# EAGLE board oresat-c3-v1_WRONG_FTDI (EAGLE 9.5.2)
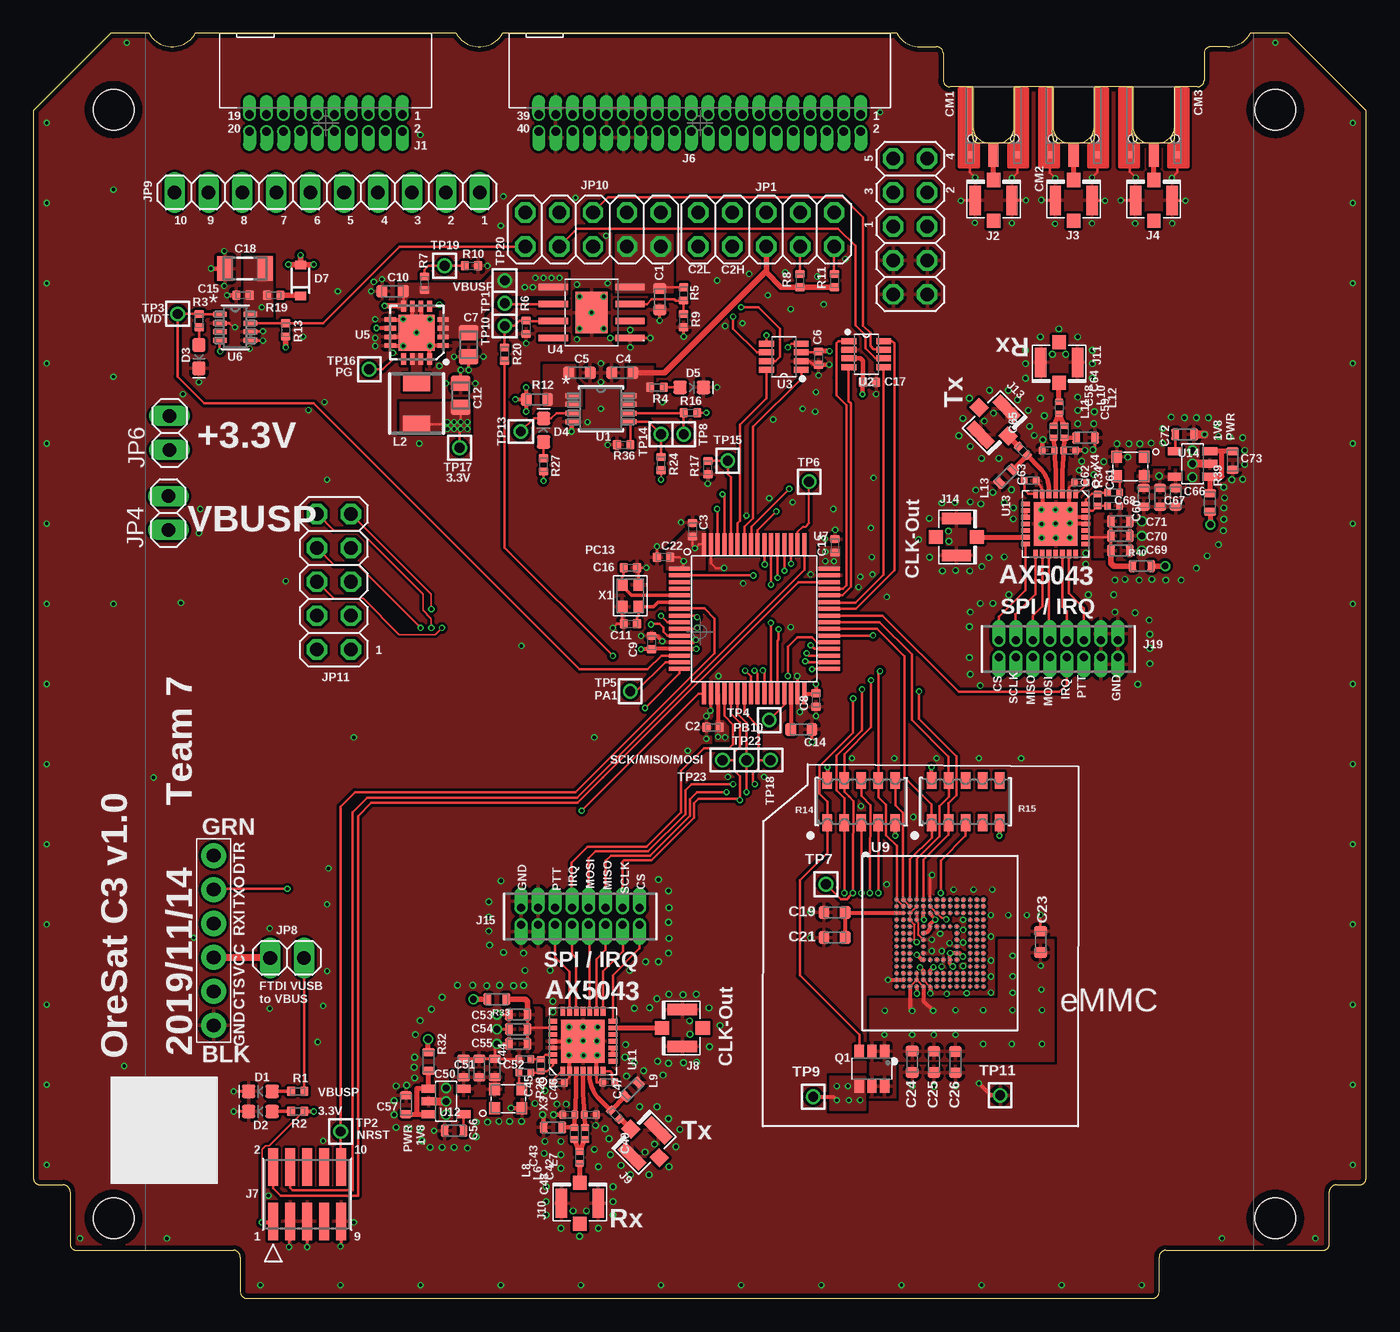
[diagram p5: board, top side]
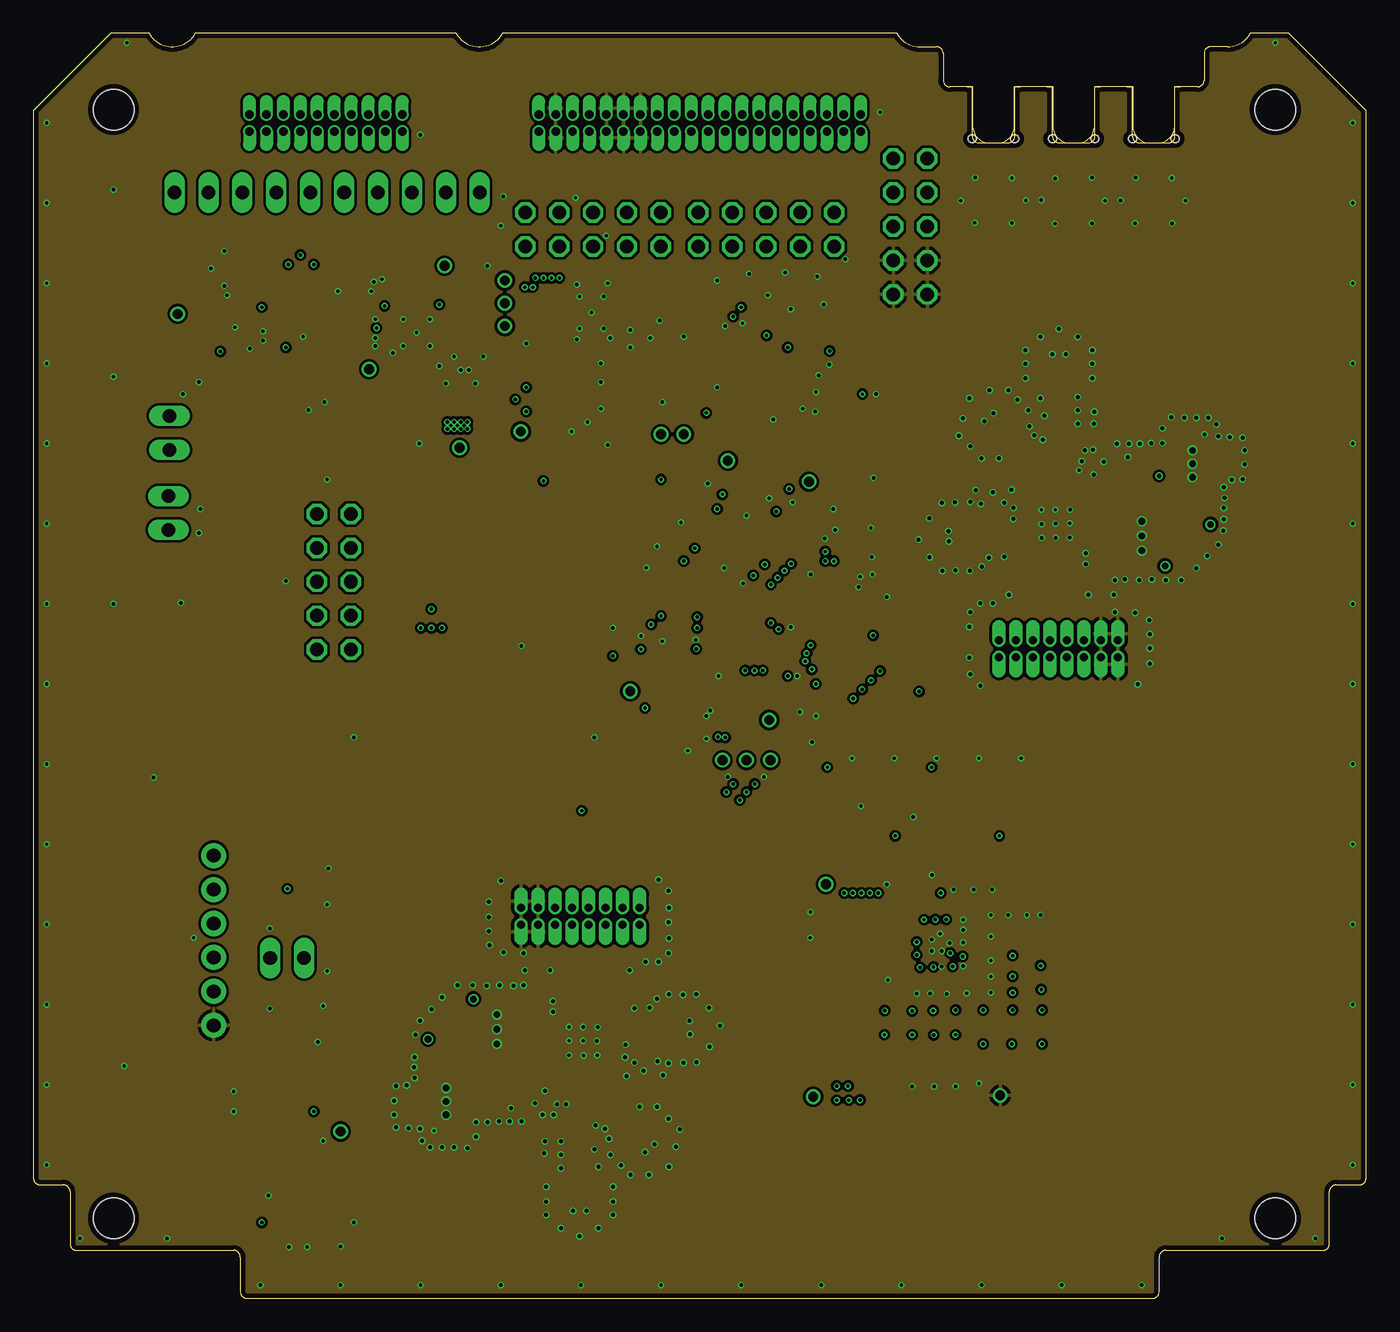
[diagram p6: board, inner layer Route2]
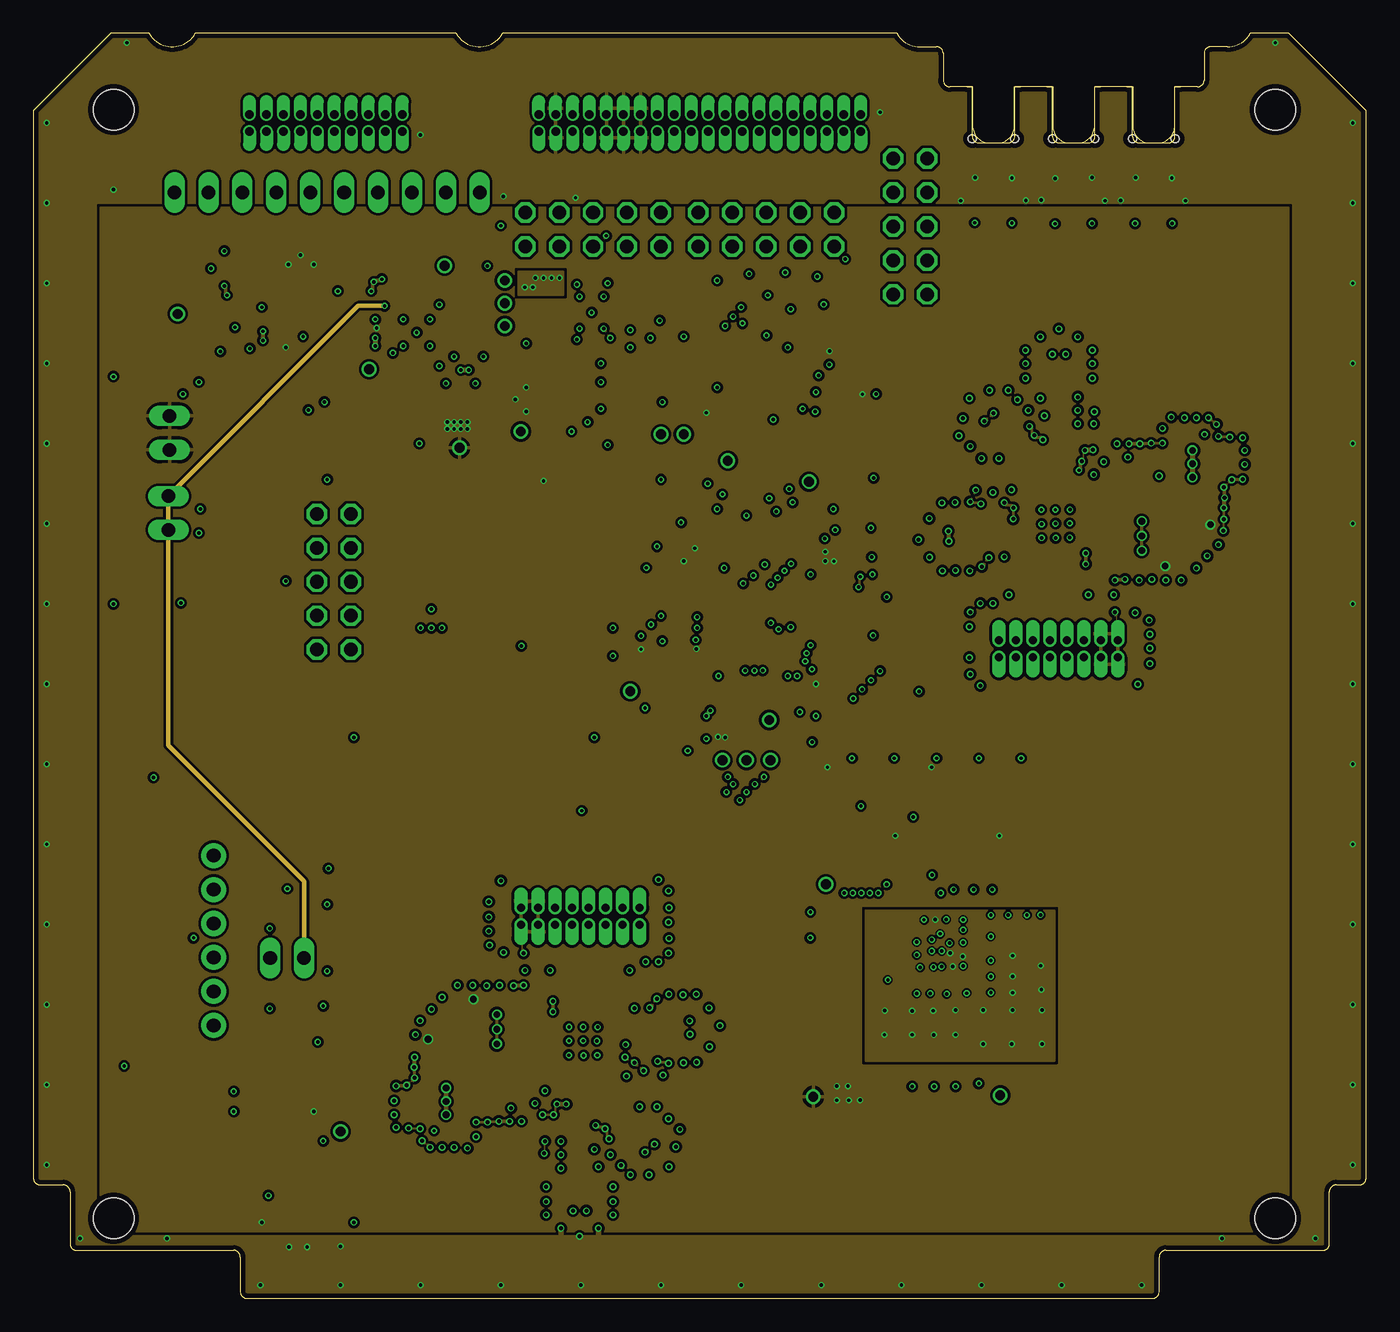
[diagram p7: board, inner layer route]
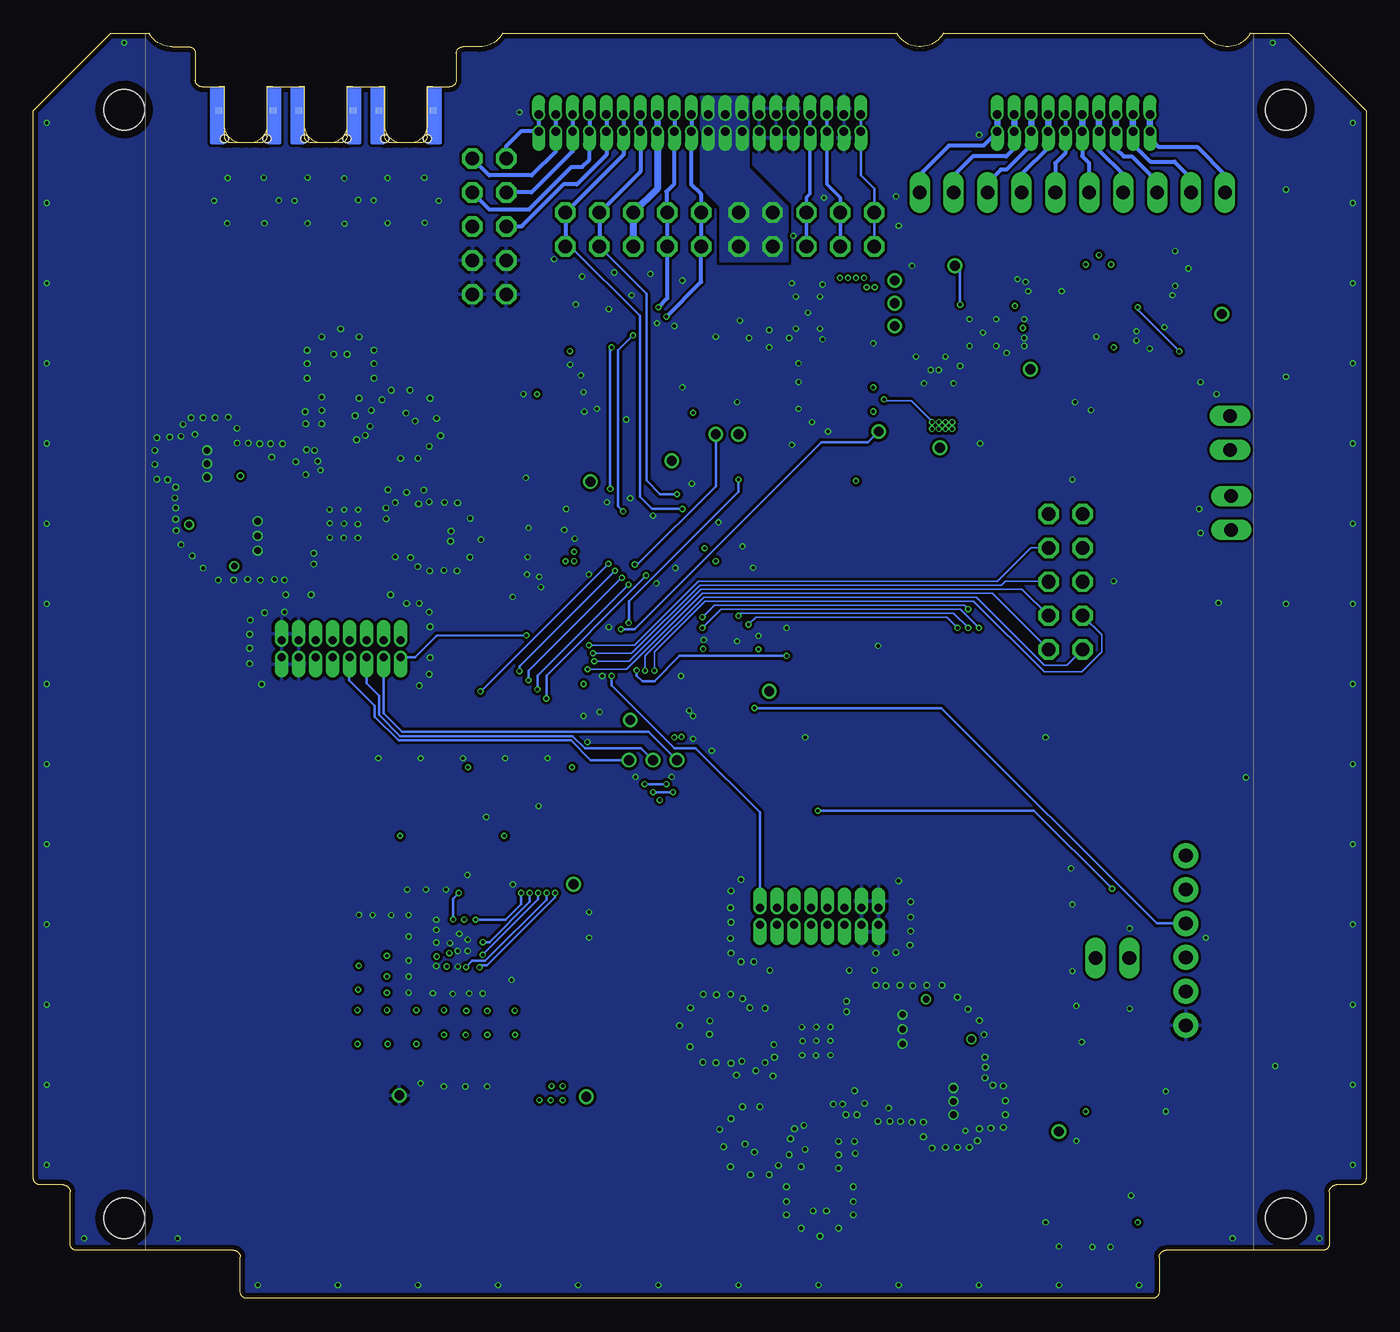
[diagram p8: board, bottom side, seen from below]

Size 99.8 x 94.7 mm. Coordinates in mm from the lower left corner, seen from the top.
Copper layers (1*2*15*16): Top 0.035559375mm / dielectric 0.17018125mm / Route2 0.01778125mm / dielectric 47mil / route 0.01778125mm / dielectric 0.17018125mm / Bottom 0.035559375mm
Design rules "oshpark-4layer *": minimum track width 5mil, minimum drill 10mil, track to track 5mil, track to pad 5mil, pad to pad 5mil, via to via 5mil, smd to smd 5mil, copper to edge 15mil, drill to drill 6mil, minimum pad ring 4mil, minimum via ring 4mil, stop-mask expansion 2.5mil, vias tented up to drill 10mil, thermal gap 10mil
Net classes: 1 RF1: clearance 0.8 mm; 2 RF2: clearance 0.4 mm

## Footprints (pad centres in the part's own frame; a part is rotated, then mirrored left to right if it is on the bottom)
.0603-B-NOSILK = smd 0.8 x 0.95: 1 -0.8,0; 2 0.8,0
.0402-B-NOSILK = smd 0.6 x 0.7: 1 -0.5,0; 2 0.5,0
.0805-B-NOSILK = smd 1.15 x 1.45: 1 -0.9,0; 2 0.9,0
1206-B = smd 1.15 x 1.8: 1 -1.5,0; 2 1.5,0
.0402-C-NOSILK = smd 0.5 x 0.6: 1 -0.45,0; 2 0.45,0
.0603-C-NOSILK = smd 0.6 x 0.9: 1 -0.7,0; 2 0.7,0
J-MOLEX-SMPM-073300-003X = smd 0.508 x 0.508: P$1 -1.778,-5.08; P$2 1.778,-5.08 | smd 0.508 x 0.508 bottom: P$3 -2.032,-1.778; P$4 2.032,-1.778 | smd 0.762 x 1.778: RF 0,-5.08 | hole 0.61: 1.587,-3.886; -1.587,-3.886
LED-0603 = smd 1 x 1: A -0.877,0; C 0.877,0
SOD-323 = smd 0.63 x 0.83: 1 -1.15,0; 2 1.15,0
STAND-OFF-TIGHT = hole 3.048: 0,0
J-SAMTEC-TFM-110-X1-XXX-D-RA = drill 0.635 pad 0.965 offset: 1 5.715,0.635; 2 5.715,-0.635; 3 4.445,0.635; 4 4.445,-0.635; 5 3.175,0.635; 6 3.175,-0.635; 7 1.905,0.635; 8 1.905,-0.635; 9 0.635,0.635; 10 0.635,-0.635; 11 -0.635,0.635; 12 -0.635,-0.635; 13 -1.905,0.635; 14 -1.905,-0.635; 15 -3.175,0.635; 16 -3.175,-0.635; 17 -4.445,0.635; 18 -4.445,-0.635; 19 -5.715,0.635; 20 -5.715,-0.635
U.FL = smd 2.2 x 0.85: 1 0,1.375; 2 0,-1.375 | smd 1.05 x 1: FEED 1.525,0; NC -1.525,0
6_PIN_SERIAL_TARGET_SIDE_W_SILK = drill 1.016 pad 1.88: P$1 -6.35,0; P$2 -3.81,0; P$3 -1.27,0; P$4 1.27,0; P$5 3.81,0; P$6 6.35,0
J-SAMTEC-TFM-120-X1-XXX-D-RA = drill 0.635 pad 0.965 offset: 1 12.065,0.635; 2 12.065,-0.635; 3 10.795,0.635; 4 10.795,-0.635; 5 9.525,0.635; 6 9.525,-0.635; 7 8.255,0.635; 8 8.255,-0.635; 9 6.985,0.635; 10 6.985,-0.635; 11 5.715,0.635; 12 5.715,-0.635; 13 4.445,0.635; 14 4.445,-0.635; 15 3.175,0.635; 16 3.175,-0.635; 17 1.905,0.635; 18 1.905,-0.635; 19 0.635,0.635; 20 0.635,-0.635; 21 -0.635,0.635; 22 -0.635,-0.635; 23 -1.905,0.635; 24 -1.905,-0.635; 25 -3.175,0.635; 26 -3.175,-0.635; 27 -4.445,0.635; 28 -4.445,-0.635; 29 -5.715,0.635; 30 -5.715,-0.635; 31 -6.985,0.635; 32 -6.985,-0.635; 33 -8.255,0.635; 34 -8.255,-0.635; 35 -9.525,0.635; 36 -9.525,-0.635; 37 -10.795,0.635; 38 -10.795,-0.635; 39 -12.065,0.635; 40 -12.065,-0.635
CON10_2X5_DUK_FTSH = smd 0.762 x 2.794: 1 -2.54,-2.032; 2 -2.54,2.032; 3 -1.27,-2.032; 4 -1.27,2.032; 5 0,-2.032; 6 0,2.032; 7 1.27,-2.032; 8 1.27,2.032; 9 2.54,-2.032; 10 2.54,2.032
2X8X1.27 = drill 0.6 pad 1.016 offset: 1 -4.445,0.635; 2 -4.445,-0.635; 3 -3.175,0.635; 4 -3.175,-0.635; 5 -1.905,0.635; 6 -1.905,-0.635; 7 -0.635,0.635; 8 -0.635,-0.635; 9 0.635,0.635; 10 0.635,-0.635; 11 1.905,0.635; 12 1.905,-0.635; 13 3.175,0.635; 14 3.175,-0.635; 15 4.445,0.635; 16 4.445,-0.635
2X05 = drill 1.016 octagon: 1 -5.08,-1.27; 2 -5.08,1.27; 3 -2.54,-1.27; 4 -2.54,1.27; 5 0,-1.27; 6 0,1.27; 7 2.54,-1.27; 8 2.54,1.27; 9 5.08,-1.27; 10 5.08,1.27
1X02 = drill 1.016 long: 1 -1.27,0; 2 1.27,0
1X10 = drill 1.016 long: 1 -11.43,0; 2 -8.89,0; 3 -6.35,0; 4 -3.81,0; 5 -1.27,0; 6 1.27,0; 7 3.81,0; 8 6.35,0; 9 8.89,0; 10 11.43,0
ECS-MPI4040 = smd 2 x 1.3: 1 0,1.575; 2 0,-1.575
SOT23-6 = smd 0.7 x 1: 1 -0.95,-1.3; 2 0,-1.3; 3 0.95,-1.3; 4 0.95,1.3; 5 0,1.3; 6 -0.95,1.3
ARRAY_EXBA-M = smd 1.27 x 0.711: 1 -1.575,2.54; 2 -1.575,1.27; 3 -1.575,0; 4 -1.575,-1.27; 5 -1.575,-2.54; 6 1.575,-2.54; 7 1.575,-1.27; 8 1.575,0; 9 1.575,1.27; 10 1.575,2.54
2MM-TEST-POINT = drill 0.737: 1 0,0
21-0036K-L = smd 1.06 x 0.376: 1 -2.134,0.975; 2 -2.134,0.325; 3 -2.134,-0.325; 4 -2.134,-0.975; 5 2.134,-0.975; 6 2.134,-0.325; 7 2.134,0.325; 8 2.134,0.975
SOT23-8_TI-DCN = smd 0.45 x 1.1: 1 -0.975,-1.3; 2 -0.325,-1.3; 3 0.325,-1.3; 4 0.975,-1.3; 5 0.975,1.3; 6 0.325,1.3; 7 -0.325,1.3; 8 -0.975,1.3
SO-POWERPAD-8 = smd 0.5 x 2.2: 1 -1.905,-2.875; 2 -0.635,-2.875; 3 0.635,-2.875; 4 1.905,-2.875; 5 1.905,2.875; 6 0.635,2.875; 7 -0.635,2.875; 8 -1.905,2.875 | smd 3.1 x 2.4: THERMAL 0,0
S-PVQFN-16 = smd 0.85 x 0.35: 1 -1.975,0.975; 2 -1.975,0.325; 3 -1.975,-0.325; 4 -1.975,-0.975; 9 1.975,-0.975; 10 1.975,-0.325; 11 1.975,0.325; 12 1.975,0.975 | smd 0.35 x 0.85: 5 -0.975,-1.975; 6 -0.325,-1.975; 7 0.325,-1.975; 8 0.975,-1.975; 13 0.975,1.975; 14 0.325,1.975; 15 -0.325,1.975; 16 -0.975,1.975 | smd 2.7 x 2.7: PAD 0,0
21-0078H-L = smd 1.016 x 0.381: 1 -1.143,0.975; 2 -1.143,0.325; 3 -1.143,-0.325; 4 -1.143,-0.975; 5 1.143,-0.975; 6 1.143,-0.325; 7 1.143,0.325; 8 1.143,0.975
QFP-10X10-64 = smd 1.6 x 0.3: 1 -5.6,3.75; 2 -5.6,3.25; 3 -5.6,2.75; 4 -5.6,2.25; 5 -5.6,1.75; 6 -5.6,1.25; 7 -5.6,0.75; 8 -5.6,0.25; 9 -5.6,-0.25; 10 -5.6,-0.75; 11 -5.6,-1.25; 12 -5.6,-1.75; 13 -5.6,-2.25; 14 -5.6,-2.75; 15 -5.6,-3.25; 16 -5.6,-3.75; 33 5.6,-3.75; 34 5.6,-3.25; 35 5.6,-2.75; 36 5.6,-2.25; 37 5.6,-1.75; 38 5.6,-1.25; 39 5.6,-0.75; 40 5.6,-0.25; 41 5.6,0.25; 42 5.6,0.75; 43 5.6,1.25; 44 5.6,1.75; 45 5.6,2.25; 46 5.6,2.75; 47 5.6,3.25; 48 5.6,3.75 | smd 0.3 x 1.6: 17 -3.75,-5.6; 18 -3.25,-5.6; 19 -2.75,-5.6; 20 -2.25,-5.6; 21 -1.75,-5.6; 22 -1.25,-5.6; 23 -0.75,-5.6; 24 -0.25,-5.6; 25 0.25,-5.6; 26 0.75,-5.6; 27 1.25,-5.6; 28 1.75,-5.6; 29 2.25,-5.6; 30 2.75,-5.6; 31 3.25,-5.6; 32 3.75,-5.6; 49 3.75,5.6; 50 3.25,5.6; 51 2.75,5.6; 52 2.25,5.6; 53 1.75,5.6; 54 1.25,5.6; 55 0.75,5.6; 56 0.25,5.6; 57 -0.25,5.6; 58 -0.75,5.6; 59 -1.25,5.6; 60 -1.75,5.6; 61 -2.25,5.6; 62 -2.75,5.6; 63 -3.25,5.6; 64 -3.75,5.6
BGA-153(11.5X13)(EMMC-BA) = smd 0.28 x 0.28: A1 -3.25,3.25; A2 -2.75,3.25; A3 -2.25,3.25; A4 -1.75,3.25; A5 -1.25,3.25; A6 -0.75,3.25; A7 -0.25,3.25; A8 0.25,3.25; A9 0.75,3.25; A10 1.25,3.25; A11 1.75,3.25; A12 2.25,3.25; A13 2.75,3.25; A14 3.25,3.25; B1 -3.25,2.75; B2 -2.75,2.75; B3 -2.25,2.75; B4 -1.75,2.75; B5 -1.25,2.75; B6 -0.75,2.75; B7 -0.25,2.75; B8 0.25,2.75; B9 0.75,2.75; B10 1.25,2.75; B11 1.75,2.75; B12 2.25,2.75; B13 2.75,2.75; B14 3.25,2.75; C1 -3.25,2.25; C2 -2.75,2.25; C3 -2.25,2.25; C4 -1.75,2.25; C5 -1.25,2.25; C6 -0.75,2.25; C7 -0.25,2.25; C8 0.25,2.25; C9 0.75,2.25; C10 1.25,2.25; C11 1.75,2.25; C12 2.25,2.25; C13 2.75,2.25; C14 3.25,2.25; D1 -3.25,1.75; D2 -2.75,1.75; D3 -2.25,1.75; D4 -1.75,1.75; D12 2.25,1.75; D13 2.75,1.75; D14 3.25,1.75; E1 -3.25,1.25; E2 -2.75,1.25; E3 -2.25,1.25; E5 -1.25,1.25; E6 -0.75,1.25; E7 -0.25,1.25; E8 0.25,1.25; E9 0.75,1.25; E10 1.25,1.25; E12 2.25,1.25; E13 2.75,1.25; E14 3.25,1.25; F1 -3.25,0.75; F2 -2.75,0.75; F3 -2.25,0.75; F5 -1.25,0.75; F10 1.25,0.75; F12 2.25,0.75; F13 2.75,0.75; F14 3.25,0.75; G1 -3.25,0.25; G2 -2.75,0.25; G3 -2.25,0.25; G5 -1.25,0.25; G10 1.25,0.25; G12 2.25,0.25; G13 2.75,0.25; G14 3.25,0.25; H1 -3.25,-0.25; H2 -2.75,-0.25; H3 -2.25,-0.25; H5 -1.25,-0.25; H10 1.25,-0.25; H12 2.25,-0.25; H13 2.75,-0.25; H14 3.25,-0.25; J1 -3.25,-0.75; J2 -2.75,-0.75; J3 -2.25,-0.75; J5 -1.25,-0.75; J10 1.25,-0.75; J12 2.25,-0.75; J13 2.75,-0.75; J14 3.25,-0.75; K1 -3.25,-1.25; K2 -2.75,-1.25; K3 -2.25,-1.25; K5 -1.25,-1.25; K6 -0.75,-1.25; K7 -0.25,-1.25; K8 0.25,-1.25; K9 0.75,-1.25; K10 1.25,-1.25; K12 2.25,-1.25; K13 2.75,-1.25; K14 3.25,-1.25; L1 -3.25,-1.75; L2 -2.75,-1.75; L3 -2.25,-1.75; L12 2.25,-1.75; L13 2.75,-1.75; L14 3.25,-1.75; M1 -3.25,-2.25; M2 -2.75,-2.25; M3 -2.25,-2.25; M4 -1.75,-2.25; M5 -1.25,-2.25; M6 -0.75,-2.25; M7 -0.25,-2.25; M8 0.25,-2.25; M9 0.75,-2.25; M10 1.25,-2.25; M11 1.75,-2.25; M12 2.25,-2.25; M13 2.75,-2.25; M14 3.25,-2.25; N1 -3.25,-2.75; N2 -2.75,-2.75; N3 -2.25,-2.75; N4 -1.75,-2.75; N5 -1.25,-2.75; N6 -0.75,-2.75; N7 -0.25,-2.75; N8 0.25,-2.75; N9 0.75,-2.75; N10 1.25,-2.75; N11 1.75,-2.75; N12 2.25,-2.75; N13 2.75,-2.75; N14 3.25,-2.75; P1 -3.25,-3.25; P2 -2.75,-3.25; P3 -2.25,-3.25; P4 -1.75,-3.25; P5 -1.25,-3.25; P6 -0.75,-3.25; P7 -0.25,-3.25; P8 0.25,-3.25; P9 0.75,-3.25; P10 1.25,-3.25; P11 1.75,-3.25; P12 2.25,-3.25; P13 2.75,-3.25; P14 3.25,-3.25
QFN28-5X5-WITH-CENTER-PAD = smd 0.65 x 0.35: 1 -2.25,1.5; 2 -2.25,1; 3 -2.25,0.5; 4 -2.25,0; 5 -2.25,-0.5; 6 -2.25,-1; 7 -2.25,-1.5; 15 2.25,-1.5; 16 2.25,-1; 17 2.25,-0.5; 18 2.25,0; 19 2.25,0.5; 20 2.25,1; 21 2.25,1.5 | smd 0.35 x 0.65: 8 -1.5,-2.25; 9 -1,-2.25; 10 -0.5,-2.25; 11 0,-2.25; 12 0.5,-2.25; 13 1,-2.25; 14 1.5,-2.25; 22 1.5,2.25; 23 1,2.25; 24 0.5,2.25; 25 0,2.25; 26 -0.5,2.25; 27 -1,2.25; 28 -1.5,2.25 | smd 3.25 x 3.25: PAD 0,0
SOT-23 = smd 1.1 x 0.6: 1 -1.3,0.95; 2 -1.3,0; 3 -1.3,-0.95; 4 1.3,-0.95; 5 1.3,0.95
CRYSTAL_2.5X2 = smd 0.9 x 0.8: 1 -0.825,-0.625; 2 0.825,-0.625; 3 0.825,0.625; 4 -0.825,0.625
2.5X2.0 = smd 0.8 x 0.9: 1 -1.025,-0.725; 2 1.025,-0.725; 3 1.025,0.725; 4 -1.025,0.725

## Placement (x,y rotation side)
C1  1u  [.0603-B-NOSILK]  46.9,74.8 270 top
C2  100n  [.0402-B-NOSILK]  50.9,42.75 0 top
C3  100n  [.0402-B-NOSILK]  49.37,57.55 270 top
C4  1u  [.0603-B-NOSILK]  44.1,69.3 180 top
C5  1u  [.0603-B-NOSILK]  40.9,69.3 0 top
C6  100n  [.0402-B-NOSILK]  58.8,70.4 90 top
C7  10u  [.0805-B-NOSILK]  32.6,71.4 270 top
C8  100n  [.0402-B-NOSILK]  58.6,44.8 90 top
C9  100n  [.0402-B-NOSILK]  46.3,49.1 270 top
C10  1u  [.0603-B-NOSILK]  26.9,75.4 180 top
C11  20p  [.0402-B-NOSILK]  44.7,50.5 180 top
C12  22u  [.0805-B-NOSILK]  32,67.6 90 top
C13  100n  [.0402-B-NOSILK]  60.03,56.35 270 top
C14  2.2u  [.0603-B-NOSILK]  57.5,42.6 0 top
C15  100n  [.0402-B-NOSILK]  15.7,75.1 180 top
C16  20p  [.0402-B-NOSILK]  44.7,54.7 0 top
C17  100n  [.0402-B-NOSILK]  62.62,68.58 180 top
C18  47u  [1206-B]  15.85,77.1 180 top
C19  2.2uF  [.0603-B-NOSILK]  60,28.9 180 top
C21  0.1u  [.0603-B-NOSILK]  60,27.02 180 top
C22  100n  [.0402-B-NOSILK]  47.2,55.5 0 top
C23  1u  [.0603-B-NOSILK]  75.42,26.69 90 top
C24  1u  [.0603-B-NOSILK]  65.81,17.72 270 top
C25  1u  [.0603-B-NOSILK]  67.43,17.71 270 top
C26  10uF  [.0603-B-NOSILK]  69.05,17.7 270 top
C42  8.2p  [.0402-C-NOSILK]  41.3,12.36 90 top
C43  8.2p  [.0402-C-NOSILK]  40.1,13.76 0 top
C44  1n  [.0402-C-NOSILK]  36.8,17.91 180 top
C45  1n  [.0402-C-NOSILK]  36.8,16.91 180 top
C46  82p  [.0402-C-NOSILK]  39.3,16.16 0 top
C47  82p  [.0402-C-NOSILK]  43.09,16.18 0 top
C48  22p  [.0402-C-NOSILK]  40.91,10.55 90 top
C49  22p  [.0402-C-NOSILK]  43.56,13.74 135 top
C50  22n  [.0603-C-NOSILK]  32.22,17.25 90 top
C51  NP  [.0603-C-NOSILK]  33.38,17.25 90 top
C52  4.7u  [.0603-C-NOSILK]  34.55,17.25 90 top
C53  22n  [.0603-C-NOSILK]  36.3,21.25 180 top
C54  NP  [.0603-C-NOSILK]  36.3,20.16 180 top
C55  4.7u  [.0603-C-NOSILK]  36.3,19.05 180 top
C56  10n  [.0603-C-NOSILK]  31.5,12.55 180 top
C57  1u  [.0603-C-NOSILK]  27.91,14.51 90 top
C58  8.2p  [.0402-C-NOSILK]  76.4,64.88 270 top
C59  8.2p  [.0402-C-NOSILK]  77.6,63.48 180 top
C60  1n  [.0402-C-NOSILK]  80.9,59.33 0 top
C61  1n  [.0402-C-NOSILK]  80.9,60.33 0 top
C62  82p  [.0402-C-NOSILK]  78.4,61.08 180 top
C63  82p  [.0402-C-NOSILK]  74.65,61.23 180 top
C64  22p  [.0402-C-NOSILK]  76.8,66.68 270 top
C65  22p  [.0402-C-NOSILK]  74.1,63.44 315 top
C66  22n  [.0603-C-NOSILK]  85.54,59.97 270 top
C67  NP  [.0603-C-NOSILK]  84.36,59.98 270 top
C68  4.7u  [.0603-C-NOSILK]  83.15,59.98 270 top
C69  22n  [.0603-C-NOSILK]  81.4,55.98 0 top
C70  NP  [.0603-C-NOSILK]  81.4,57.08 0 top
C71  4.7u  [.0603-C-NOSILK]  81.4,58.18 0 top
C72  10n  [.0603-C-NOSILK]  86.2,64.68 0 top
C73  1u  [.0603-C-NOSILK]  89.8,62.73 270 top
CM1  J-MOLEX-SMPM-73300-003X  [J-MOLEX-SMPM-073300-003X]  71.9,90.7 0 top
CM2  J-MOLEX-SMPM-73300-003X  [J-MOLEX-SMPM-073300-003X]  77.9,90.7 0 top
CM3  J-MOLEX-SMPM-73300-003X  [J-MOLEX-SMPM-073300-003X]  83.9,90.7 0 top
D1  GREEN  [LED-0603]  17,15.5 180 top
D2  GREEN  [LED-0603]  17,14 180 top
D3  GREEN  [LED-0603]  12.4,70.5 270 top
D4  GREEN  [LED-0603]  38.2,65 90 top
D5  GREEN  [LED-0603]  49.3,68.2 0 top
D7  1N4148  [SOD-323]  20,76.2 90 top
H1  STAND-OFFTIGHT  [STAND-OFF-TIGHT]  93,6 0 top
H2  STAND-OFFTIGHT  [STAND-OFF-TIGHT]  93,89 0 top
H3  STAND-OFFTIGHT  [STAND-OFF-TIGHT]  6,89 0 top
H4  STAND-OFFTIGHT  [STAND-OFF-TIGHT]  6,6 0 top
J1  J-SAMTEC-TFM-110-X1-XXX-D-RA  [J-SAMTEC-TFM-110-X1-XXX-D-RA]  21.9,87.99 0 top
J2  U.FL  [U.FL]  71.9,82.2 90 top
J3  U.FL  [U.FL]  77.9,82.2 90 top
J4  U.FL  [U.FL]  83.9,82.2 90 top
J5  [6_PIN_SERIAL_TARGET_SIDE_W_SILK]  13.5,26.8 270 top
J6  J-SAMTEC-TFM-120-X1-XXX-D-RA  [J-SAMTEC-TFM-120-X1-XXX-D-RA]  49.9,87.99 0 top
J7  FTSH-105-XX-X-DV-K  [CON10_2X5_DUK_FTSH]  20.5,7.8 0 top
J8  U.FL  [U.FL]  48.6,20.25 180 top
J9  U.FL  [U.FL]  45.8,11.62 135 top
J10  U.FL  [U.FL]  40.92,7.13 90 top
J11  U.FL  [U.FL]  76.81,70.07 270 top
J13  U.FL  [U.FL]  71.91,65.63 315 top
J14  U.FL  [U.FL]  69.12,57 0 top
J15  HARWIN-2X8X1.27  [2X8X1.27]  40.95,28.61 180 top
J19  HARWIN-2X8X1.27  [2X8X1.27]  76.75,48.63 0 top
JP1  [2X05]  54.88,80.01 180 top
JP2  [2X05]  65.66,80.25 270 top
JP4  [1X02]  10.1,58.8 90 top
JP6  [1X02]  10.2,64.8 90 top
JP8  [1X02]  19,25.5 180 top
JP9  [1X10]  22,82.8 180 top
JP10  [2X05]  41.91,80.01 180 top
JP11  [2X05]  22.5,53.65 90 top
L2  6.8u  [ECS-MPI4040]  28.7,67 0 top
L6  43n  [.0402-C-NOSILK]  40.51,12.36 90 top
L7  43n  [.0402-C-NOSILK]  41.7,13.76 180 top
L8  91n  [.0603-C-NOSILK]  38.91,12.8 180 top
L9  91n  [.0603-C-NOSILK]  44.81,15.64 225 top
L10  43n  [.0402-C-NOSILK]  77.2,64.88 270 top
L11  43n  [.0402-C-NOSILK]  76,63.48 0 top
L12  91n  [.0603-C-NOSILK]  78.8,64.43 0 top
L13  91n  [.0603-C-NOSILK]  72.85,61.54 45 top
Q1  MOSFET-PCH-SOT23-6  [SOT23-6]  62.79,17.2 180 top
R1  2.7k  [.0402-B-NOSILK]  19.8,15.5 0 top
R2  2.7k  [.0402-B-NOSILK]  19.8,14 0 top
R3  2.7k  [.0402-B-NOSILK]  12.4,73.2 90 top
R4  2.7k  [.0402-B-NOSILK]  46.7,68.2 180 top
R5  31.7k  [.0402-B-NOSILK]  48.7,75.2 89.8 top
R6  3.1k  [.0402-B-NOSILK]  36.9,72.7 90 top
R7  10k  [.0402-B-NOSILK]  29.3,76 270 top
R8  4.7k  [.0402-B-NOSILK]  57.4,76.2 90 top
R9  10k  [.0402-B-NOSILK]  48.7,73.2 90 top
R10  NP  [.0402-B-NOSILK]  32.8,77.3 180 top
R11  4.7k  [.0402-B-NOSILK]  60,76.2 90 top
R12  0  [.0603-B-NOSILK]  37.7,67.3 180 top
R13  4.7k  [.0402-B-NOSILK]  18.9,72.5 90 top
R14  10k  [ARRAY_EXBA-M]  62,37.2 90 top
R15  10k  [ARRAY_EXBA-M]  69.8,37.2 90 top
R16  10k  [.0402-B-NOSILK]  49.2,66.3 0 top
R17  10k  [.0402-B-NOSILK]  50.5,62.2 90 top
R19  10  [.0402-B-NOSILK]  18,75.1 0 top
R20  10k  [.0402-B-NOSILK]  35.3,70.7 270 top
R24  10k  [.0402-B-NOSILK]  47,62.5 270 top
R27  10k  [.0402-B-NOSILK]  38.2,62.4 270 top
R28  150  [.0402-C-NOSILK]  38.01,17.45 270 top
R32  0  [.0603-C-NOSILK]  29.59,17.75 270 top
R33  0  [.0603-C-NOSILK]  34.7,22.41 180 top
R34  150  [.0402-C-NOSILK]  79.7,59.78 90 top
R36  23.9k  [.0402-B-NOSILK]  44.2,63.9 0 top
R39  0  [.0603-C-NOSILK]  88.1,59.58 90 top
R40  0  [.0603-C-NOSILK]  83,54.83 0 top
TP1  TEST-POINT  [2MM-TEST-POINT]  35.3,74.5 90 top
TP2  TEST-POINT  [2MM-TEST-POINT]  23,12.5 0 top
TP3  TEST-POINT  [2MM-TEST-POINT]  10.8,73.7 0 top
TP4  TEST-POINT  [2MM-TEST-POINT]  55.1,43.3 0 top
TP5  TEST-POINT  [2MM-TEST-POINT]  44.7,45.45 0 top
TP6  TEST-POINT  [2MM-TEST-POINT]  58.09,61.15 0 top
TP7  TEST-POINT  [2MM-TEST-POINT]  59.35,31.01 0 top
TP8  TEST-POINT  [2MM-TEST-POINT]  48.7,64.7 0 top
TP9  TEST-POINT  [2MM-TEST-POINT]  58.4,15.1 0 top
TP10  TEST-POINT  [2MM-TEST-POINT]  35.3,72.8 90 top
TP11  TEST-POINT  [2MM-TEST-POINT]  72.4,15.2 0 top
TP13  TEST-POINT  [2MM-TEST-POINT]  36.5,64.9 90 top
TP14  TEST-POINT  [2MM-TEST-POINT]  47,64.7 0 top
TP15  TEST-POINT  [2MM-TEST-POINT]  52,62.7 180 top
TP16  TEST-POINT  [2MM-TEST-POINT]  25.15,69.55 180 top
TP17  TEST-POINT  [2MM-TEST-POINT]  31.91,63.68 180 top
TP18  TEST-POINT  [2MM-TEST-POINT]  55.2,40.3 90 top
TP19  TEST-POINT  [2MM-TEST-POINT]  30.8,77.3 180 top
TP20  TEST-POINT  [2MM-TEST-POINT]  35.3,76.2 90 top
TP22  TEST-POINT  [2MM-TEST-POINT]  53.4,40.3 90 top
TP23  TEST-POINT  [2MM-TEST-POINT]  51.6,40.3 90 top
U1  MAX892LEUA+T21-0036K-L  [21-0036K-L]  42.5,66.6 0 top
U2  TCAN330  [SOT23-8_TI-DCN]  62.37,70.69 270 top
U3  TCAN330  [SOT23-8_TI-DCN]  56.2,70.5 90 top
U4  TPS259621 - eFuse  [SO-POWERPAD-8]  41.8,73.8 90 top
U5  TPS62111RSA  [S-PVQFN-16]  28.7,72.3 180 top
U6  MAX6374KA-T21-0078H-L  [21-0078H-L]  15.11,72.69 0 top
U7  STM32F446RE  [QFP-10X10-64]  53.98,50.88 0 top
U9  SFEM016GB1EM1TO-A-HG-111-STD  [BGA-153(11.5X13)(EMMC-BA)]  67.9,26.6 0 top
U11  U-ONSEMI-AX5043  [QFN28-5X5-WITH-CENTER-PAD]  41.16,19.25 90 top
U12  LP2985XX-N  [SOT-23]  30.91,14.76 0 top
U13  U-ONSEMI-AX5043  [QFN28-5X5-WITH-CENTER-PAD]  76.55,57.98 270 top
U14  LP2985XX-N  [SOT-23]  86.8,62.48 180 top
U$1  ORESAT-CARD-V1.1-3XRF  [ORESAT-CARD-V1.1-3XRF]  0,0 0 top
X1  16MHZ-2.5x2mm  [CRYSTAL_2.5X2]  44.7,52.6 270 top
X3  TAITIEN-TY  [2.5X2.0]  35.55,14.96 0 top
X4  TAITIEN-TY  [2.5X2.0]  82.15,62.28 180 top

## Tracks (layer width: path | path; a pad name or v marks a point on that pad's centre or on a via)
1V1
  pour Top: 35.05,16.95 31.36,16.95 31.36,16.25 31.86,16.25 31.86,15.15 35.05,15.15
1V2  (via drill 0.35)
  other vias: 84.3,61.57
  pour Top (isolate 0.2): 82.65,60.28 86.35,60.28 86.35,60.98 85.85,60.98 85.85,62.08 82.65,62.08
3.3V  (via drill 0.25, 0.5)
  Top 0.127: R2.2 20.19,13.97 17.65,11.43 17.4,11.43 17.14,11.18 17.14,5.84 v17.1,5.7
  Top 0.152: U7.19 51.25,45.26 | 51.25,42.9 C2.2
  Top 0.2: 58.73,70.83 U3.3 | 46.33,48.62 C9.2 | v50.4,66.3 R16.2 | TP17.1 31.91,65.01 v32,65.1 | R27.2 v38.2,61.2 | L2.2 30.82,65.42 v31,65.6 | C12.1 v32,65.6 | C22.2 48.4,55.5 v48.7,55.2 48.7,54.94 U7.1 | C3.2 49.37,56.33 v49.54,56.16 49.85,56.48 U7.64
  Top 0.3: R2.2 v21,14 | 51.25,45.26 51.25,42.9 | v49.65,48.62 U7.13 46.33,48.62 45.52,48.62 v45.5,48.6 | U7.32 58.58,45.27 C8.2 v58.6,46 | R12.2 v36.9,66.4 | v36.1,67.3 R12.2 | v36.9,68.2 R12.2 | v17.1,5.7 17.89,5.7 J7.1 | v59.46,39.77 R14.10 | v64.54,34.63 R14.5 | R15.10 v67.26,39.77 | TP9.1 59.91,15.1 v60.17,14.84 | R15.5 v72.34,34.63 | U5.10 25.7,72.62 v25.7,72.65
  Top 0.305: C6.2 58.73,70.83
  Top 0.35: U2.3 61.94,70.36 62.12,70.18 C17.2 62.08,68.54 v62.08,67.69
  Top 0.39: R39.1 88.15,58.83 v88.15,57.93 | R32.1 29.55,18.48 v29.55,19.41 | v59.62,70.91 59.6,70.9 C6.2
  Top 0.4: v20,78.1 D7.2 20.05,77.4 | v21,77.4 20.05,77.4 | v19.1,77.4 20.05,77.4 | v18.9,71.2 R13.1 | R33.2 v32.95,22.41 | R40.2 v84.75,54.83
  Bottom 0.127: v36.1,67.3 36.07,67.18 34.04,67.18 32.51,65.66 v32.5,65.6
  other vias: 51.27,42.05 51.8,42 32.5,65.1 59.3,55.2 59.3,55.9 31.5,65.6 31.5,65.1 31,65.1 59.95,55.19 61.9,14.85 61.06,14.84 61,15.9 60.17,15.9
  pour Top (isolate 0.2, no thermals): 27.45,67.1 32.7,67.1 32.7,64.8 27.45,64.8
  pour route (isolate 0.2, rank 3): 5,81.7 94,81.7 94,5 5,5
  pour Top (isolate 0.2, no thermals): 50.3,57.4 48.9,57.4 47.4,55.9 47.4,54.6 50.3,54.6
  pour Top (no thermals): 60.35,56.25 58.85,56.25 58.85,54.55 60.35,54.55
  pour Top (isolate 0.2, no thermals): 51.1,43.2 51.1,41.75 52.1,41.75 52.1,43.2
  pour Top (no thermals): 62.29,16.58 59.64,16.58 59.64,14.14 62.32,14.14 62.32,15.32
!CB_FLT
  Top 0.2: U4.6 35.37,74.44 TP1.1
!OPD_ENABLE  (via drill 0.25)
  Top 0.2: v55.8,50.1 55.8,49.3 55.73,49.23 U7.28 | U1.3 39.17,66.28 38.78,65.88 D4.C 37.48,65.88 TP13.1
  Bottom 0.2: TP13.1 37.3,64.1 40.8,64.1 54.8,50.1 v55.8,50.1
!SD
  Top 0.2: JP10.10 27.44,78.74 21.7,73 R13.2 18.89,73.02 U6.7
  Bottom 0.2: J6.39 J6.40 37.84,84.06 36.83,83.06 JP10.9 JP10.10
ANTN1
  Top 0.35: U11.4 41.16,15.36 L7.2 C42.2
ANTN2
  Top 0.35: U13.4 76.55,61.88 L11.2 C58.2
ANTP2
  Top 0.35: U11.3 40.66,15.36 C43.2 L6.2 L8.1
ANTP3
  Top 0.35: U11.5 41.66,16.71 arc45 42.4,14.91 C49.2 44.32,15.14 L9.2
ANTP4
  Top 0.35: U13.3 77.05,61.88 C59.2 L10.2 L12.1
ANTP5
  Top 0.35: U13.5 76.05,60.55 arc45 75.39,62.15 C65.2 74.42,63.11 L13.2
AUX-1
  Bottom 0.3: J1.2 27.61,87.33 28.65,86.3 31.25,86.3 33.45,84.1 33.45,83.32 JP9.1
  Bottom 0.5: J1.2 J1.1
AUX-2
  Bottom 0.3: J1.4 26.34,86.11 26.95,85.5 29.45,85.5 30.95,84 30.89,83.94 JP9.2
  Bottom 0.5: J1.4 J1.3
AUX-3
  Bottom 0.3: J1.6 25.07,86.38 26.95,84.5 27.35,84.5 28.35,83.5 JP9.3
  Bottom 0.5: J1.6 J1.5
AUX-4
  Bottom 0.3: J1.8 23.8,86.14 25.81,84.14 JP9.4
  Bottom 0.5: J1.8 J1.7
AUX-5
  Bottom 0.3: JP9.5 23.27,84.98 22.54,85.72 J1.10 J1.9
AUX-6
  Bottom 0.3: J1.12 21.27,85.52 20.75,85 20.75,83.32 JP9.6
  Bottom 0.5: J1.12 J1.11
AUX-7
  Bottom 0.3: J1.14 20,85.94 18.19,84.14 JP9.7
  Bottom 0.5: J1.14 J1.13
AUX-8
  Bottom 0.3: J1.16 18.73,86.08 18.15,85.5 17.55,85.5 15.65,83.6 JP9.8
  Bottom 0.5: J1.16 J1.15
AUX-9
  Bottom 0.3: J1.18 17.45,86.41 16.15,85.1 14.35,85.1 13.11,83.86 JP9.9
  Bottom 0.5: J1.18 J1.17
AUX_!SHUTDOWN
  Bottom 0.3: J1.20 16.18,86.83 15.55,86.2 12.65,86.2 10.55,84.1 10.57,84.08 JP9.10
  Bottom 0.5: J1.20 J1.19
BOOT0
  Top 0.203: R17.2 TP15.1 52,61.7 52.23,61.47 U7.60
CAN1_H
  Top 0.152: U2.7 63.71,71.06
  Top 0.2: 63.71,71.06 62.91,71.06 62.67,71.3 62.67,72.29 62.13,72.83 62.13,80.92 60.63,82.42 43.02,82.42 41.91,81.31 JP10.5
  Bottom 0.25: J6.33 J6.34 41.65,82.69 41.9,82.43 JP10.5 JP10.6
CAN1_L
  Top 0.2: JP10.8 40.72,80.08 60.26,80.08 61.55,78.78 61.55,72.86 62.32,72.1 62.32,71.12 63.07,70.36 U2.6
  Bottom 0.25: J6.35 J6.36 40.38,83.41 39.37,82.4 JP10.7 JP10.8
CAN1_RX
  Top 0.2: U2.4 61.05,69.69 61.05,67.15 61.21,67 61.21,53.27 60.57,52.62 U7.44
CAN1_SHDN
  Top 0.152: 60.25,52.07 59.75,52.07 59.7,52.12 U7.43 60.2,52.12 60.25,52.07
  Top 0.2: 60.25,52.07 61.55,52.07 63.67,54.19 U2.5
CAN1_SILENT
  Top 0.152: U7.42 60.09,51.62 60.1,51.62
  Top 0.2: 60.1,51.62 61.58,51.62 64.47,54.51 64.47,71.49 64.3,71.67 U2.8
CAN1_TX
  Top 0.2: U7.45 60.6,53.12 60.88,53.4 60.88,66.86 60.12,67.62 60.12,68.96 60.12,71.49 60.3,71.67 U2.1
CAN2_H  (via drill 0.25)
  Top 0.2: U3.7 55.57,70.17 55.9,70.5 55.9,72.6 54.3,74.2 v53,74.2
  Bottom 0.3: J6.17 J6.18 51.84,87.33 51.84,83.41 | JP1.7 JP1.8 52.34,74.87 52.34,74.86
  Bottom 0.305: 51.84,83.41 52.39,82.85 52.39,81.33 JP1.7 | 52.34,74.86 v53,74.2
CAN2_L  (via drill 0.25)
  Top 0.152: U3.6
  Top 0.2: U3.6 54.17,70.83 52.4,72.6 v52.4,73.5
  Bottom 0.3: J6.19 J6.20 50.55,87.35 50.55,83.42
  Bottom 0.305: v52.4,73.5 49.8,76.1 JP1.10 JP1.9 49.82,81.3 49.82,82.69 50.55,83.42
CAN2_RX  (via drill 0.25)
  Top 0.152: U7.57 53.76,56.5
  Top 0.2: U3.4 56.77,71.47 v56.5,71.2 | v56.6,60.6 53.76,57.76 53.76,56.5
  Bottom 0.2: v56.5,71.2 56.6,71.1 v56.6,60.6
CAN2_SHDN  (via drill 0.25)
  Top 0.2: U3.5 v54.9,72.1 | U7.56 54.23,57.52 v55.63,58.91
  Bottom 0.152: 56.03,70.97 v54.9,72.1
  Bottom 0.2: 56.03,70.97 56.03,59.31 v55.63,58.91
CAN2_SILENT
  Top 0.2: U3.8 54.9,67.4 52.9,65.4 52.9,58.2 52.73,58.03 U7.59
CAN2_TX
  Top 0.152: U7.58 53.26,56.5
  Top 0.2: U3.1 57.5,68.86 53.9,65.26 53.9,58.4 53.26,57.75 53.26,56.5
CB_IOUT
  Top 0.2: U4.7 36.94,73.17 R6.2 36.4,73.2 36,72.8 TP10.1 R20.1
CB_IOUT_IN  (via drill 0.25)
  Top 0.2: U7.26 54.73,46.87 54.6,47 v54.62,47.02 | v43.4,48.1 35.3,56.2 R20.2
  Bottom 0.2: v54.62,47.02 54.62,46.62 54.2,46.2 53.3,46.2 51.4,48.1 v43.4,48.1
CLKN1
  Top 0.2: C44.1 R28.1 38.35,18.25 U11.27
CLKN2
  Top 0.2: C60.1 R34.1 79.35,58.98 U13.27
CLKP1
  Top 0.2: U11.28 38.91,17.45 38.45,17 R28.2 37.91,16.91 C45.1
CLKP2
  Top 0.2: U13.28 78.8,59.78 79.25,60.23 R34.2 79.8,60.33 C61.1
CRYSTALIN
  Top 0.2: C16.1 44.2,54.1 44.08,53.98 X1.1
  Top 0.254: X1.1 44.08,53.34 44.79,52.62 U7.5
CRYSTALOUT
  Top 0.2: C11.1 45.2,51 45.33,51.12 X1.3
  Top 0.254: X1.3 46.42,51.77 46.77,52.12 U7.6
CS1
  Top 0.2: U11.14 43.41,24.2 45.41,26.2 J15.1
CS2
  Top 0.2: U13.14 74.3,53.03 72.3,51.03 J19.1
EN/UVLO
  Top 0.2: R9.2 R5.1 48.1,74.7 48,74.8 46.3,74.8 45.94,74.44 U4.3
GND  (via drill 0.25, 0.3, 0.5)
  Top 0.152: U9.C4 U9.D4 66.15,28.23 66.27,28.11 66.27,27.22 66.5,26.99 66.51,26.99 U9.G5 | U9.N5 U9.P6
  Top 0.2: U3.2 58.12,70.17 58.4,69.9 C6.1 | C46.2 40.16,16.55 U11.2 | C47.1 42.16,16.18 U11.6 | U11.6 | C62.2 77.55,60.68 U13.2 | v51.72,54.68 51.1,54.68 50.73,55.05 U7.63 | C50.2 C51.2 C52.2 | C52.2 34.55,18.91 v34.7,19.05 C55.2 | C44.2 34.6,17.91 C52.2 | v34.7,20.16 C54.2 | v34.7,21.25 C53.2 | L12.2 79.5,63.68 v79.35,63.53 | v19.14,3.85 19.14,5.68 J7.3 | v20.5,3.85 J7.5 | R9.1 v48.7,72 | C1.2 v46.9,73.2 | U4.1 v46.2,71.9 | CM3.P$2 85.68,84.3 v85.25,83.88 | CM3.P$1 82.12,84.33 v82.55,83.9 | CM2.P$2 79.68,84.3 v79.28,83.9 | CM2.P$1 76.12,84.25 v76.53,83.85 | CM1.P$2 73.68,84.28 v73.28,83.88 | CM1.P$1 70.12,84.3 v70.53,83.9 | v69.45,82.17 69.47,82.2 J2.1 | v74.33,82.2 J2.2 | v75.47,82.22 76.5,82.22 J3.1 | v80.25,82.17 79.3,82.17 J3.2 | v81.42,82.2 J4.1 | v86.28,82.17 85.3,82.17 J4.2 | v15.1,72.7 14.99,72.7 14.68,73.02 U6.2 | v17.2,72.4 16.29,72.4 U6.6 | v17.2,71.7 16.27,71.7 U6.5 | C12.2 v32,69.5 | U9.A6 67.15,31.55 v67.3,31.7 | v43.4,50.2 43.7,50.5 C11.2 44.08,50.62 X1.2 | v32.6,69.5 C7.2 | J7.9 23.04,3.94 v23,3.9 | U7.31 57.2,45.31 v57.2,46.6 | v50.7,44 50.7,45.24 U7.18 | v58.31,41.65 C14.2 | v45.9,54.7 C16.2 45.33,54.58 X1.4 | v46.7,56.3 C22.1 | v75.42,28.71 C23.2 | v15,14 D2.C | v15,15.5 D1.C | C63.1 75.16,61.17 arc-45 U13.6
  Top 0.254: v66.15,22.83 U9.P4
  Top 0.3: 28.38,72.62 U5.PAD 29.02,72.62 | v49.6,49.3 49.42,49.12 U7.12 | v47.1,49.2 46.7,49.6 C9.1 | U9.P6 v67.16,22.84 | TP11.1 71.7,15.2 v70.8,16.1 | U13.6 75.55,59.04 v75.48,59.04 | U13.2 77.55,59.05 v77.62,59.05 | U13.25 77.61,57.98 v77.61,58.03 77.61,58.48 U13.26 | U11.2 40.16,18.21 v40.1,18.21 | U11.6 42.16,18.21 v42.23,18.21 | U11.25 40.11,19.25 v40.11,19.29
  Top 0.305: U5.PAD 27.73,73.28 U5.9 | U5.PAD 28.38,71.97 U5.11 | U5.PAD 28.7,72 28,71.3 26.75,71.3 U5.12 | 29.68,71.33 U5.PAD | U5.6 29.02,72.62 | U5.7 28.38,72.62 | U5.16 29.68,71.33 | U5.1 29.68,71.33 | v63.99,23.85 U9.N1 U9.N2
  Top 0.35: v38.95,13.76 C43.1 | v38.12,13.76 38.2,13.68 L8.2 | v35.76,14.26 35.78,14.23 X3.2 | v40.3,64.9 40.3,65.56 U1.4 | v59.6,69.9 C6.1 | C18.2 v13.3,77.1 | C15.2 v14.5,75.1 | L11.1 75.55,64.23 v75.6,64.28 | C59.1 v78.75,63.48
  Top 0.6: U12.2 v30.91,14.76 | U14.2 v86.8,62.48 | C72.2 v87.7,64.68
  other vias: 3.5,4.5 1,16 1,40 1,58 1,64 1,70 1,76 1,82 1,88 7,94 10,4.5 23,1 41,1 59,1 65,1 71,1 17.7,27.7 25.6,71.3 25.3,75.4 25.6,73.3 26.92,70.78 31.5,70.5 30.4,69.8 33.7,70.5 40.6,82.4 35.2,82.5 42.89,79.55 63.4,88.8 35,1 28.98,87.1 58.8,69.1 79.28,80.47 76.5,80.45 70.5,80.53 1,10 98.8,28 98.8,34 98.8,40 98.8,46 98.8,64 55.4,65.8 59.18,74.42 40.7,71.8 36.9,71.5 20.2,72 26.1,76.3 44.7,71.2 44.7,72.5 43.2,71.9 40.7,75.9 43,76 51.3,46.6 56.71,50.25 63.91,52.52 62.83,54.2 61.79,53.25 61.92,54.03 56.71,74.06 28.9,64 12.5,59.1 22,61.3 12.4,68.6 49,41 45.5,49.6 58.6,43.6 57.4,43.9 58.2,54.2 50.4,43.6 50.4,41.9 40.9,72.6 40.9,75 42.7,75 42.7,72.6 55,75.1 34,77.3 25.5,76.1 33.1,68.5 30.9,68.5 14.3,78.4 14.3,75.8 16.2,71.1 11.2,67.7 42.5,70 42.5,68.6 42.5,66.6 41.5,65.6 28.7,72.3 29.7,73.3 27.7,73.3 29.7,71.3 58.55,66.39 58.6,67.85 55.1,59.9 57.6,66.6 60.8,77.8 58.7,76.5 22.8,75.4 20.6,66.5 21.8,67.1 11.05,52.07 18.9,53.7 22.1,32.2 22,29.5 22,24.5 21.3,19.2 42,42 9,39 53.4,58.6 59.9,59.1 60.04,57.54 62.78,55.5 62.92,61.43 56.85,59.6 54.71,39.05 52.01,39.05 89,4.5 6,83 6,69 6,52 21.7,21.9 21.7,11.8 17.6,7.7 93,94 98.8,88 98.8,82 98.8,76 98.8,70 85.28,80.47 82.5,80.47 98.8,58 73.28,80.5 98.8,52 56.3,76.8 53.6,76.7 51.2,76.2 51.8,72.8 53.1,73 98.8,22 51.2,68.2 41.8,73.8 62.72,57.68 98.8,16 47.1,67.1 35,80.3 50.5,61 53.15,53.53 98.8,10 48.5,58.1 43,63.9 96,4.5 25.6,71.9 27.7,71.3 36.55,48.85 83,1 77,1 12.4,57.3 24,42 1,52 53,1 1,46 47,1 12,27 17.7,21.7 1,34 1,28 29,1 24,5.7 1,22 6.8,17.4 17,1 30.91,15.76 30.91,13.76 34.85,13.26 38.3,15.55 30,12.55 43.41,6.25 43.41,7.25 42.3,5.25 43.41,8.36 42.3,9.86 42.01,11.15 38.41,6.25 38.41,8.36 39.51,5.25 38.41,7.25 39.51,9.76 39.51,11.76 42.1,12.96 42.8,12.71 39.91,14.55 45.01,17.66 39.51,10.76 36.55,13.26 38.3,11.76 45.7,17.05 45.41,14.36 48.1,11.36 44.7,9.26 46.1,9.26 47.6,9.86 46.51,11.55 46.7,14.36 47.55,13.46 48.41,12.65 43.2,10.76 43.1,11.96 44.01,9.96 49.67,17.68 50.62,18.85 48.69,17.65 51.42,20.43 47.55,17.61 50.59,21.75 46.16,21.77 48.65,22.74 46.69,22.44 47.59,22.77 45,21.73 46.76,17.75 44.35,19 49.64,22.77 49.18,19.79 40.41,6.55 49.14,20.78 41.41,6.55 47.14,16.72 46.8,31.36 34.1,28.55 36.7,25.86 34.1,27.5 32.91,23.45 31.75,23.45 33.95,23.41 34.91,23.45 35.95,23.41 30.61,22.55 34.1,29.7 35.01,31.25 29.7,11.3 30.61,11.3 31.5,11.3 32.51,11.26 33.16,12.11 33.16,13.21 34.01,13.21 40.91,4.66 45.8,10.96 28.61,19.75 47.55,25.86 44.66,24.55 47.55,28.16 45.85,25.2 47.6,26.95 47.55,30.5 47.6,29.25 46.8,25.2 38.7,24.55 29.8,21.66 35.2,25.91 36.8,24.55 38.91,21.45 38.91,22.25 44.3,18.05 44.41,16.64 28.11,12.76 37.55,14.61 38.26,10.86 35.66,13.26 27,13.76 27.16,12.8 28.5,17.3 28.95,20.8 28.55,16.5 28.55,18.05 27.95,15.96 34.16,26.45 36.7,23.45 29.11,11.8 28.95,12.71 27.16,15.9 27,14.8 39.2,14.55 86.8,61.48 86.8,63.48 81.95,62.98 82.85,63.98 79.4,61.68 83,55.98 83,57.08 83,58.18 74.3,70.98 74.3,69.98 75.4,71.98 74.3,68.88 75.4,67.38 75.7,66.08 79.3,70.98 79.3,68.88 78.2,71.98 79.3,69.98 78.2,67.48 78.2,65.48 74.95,64.61 72.7,59.58 78.2,66.48 81.15,63.98 79.4,65.48 71.85,60.34 72.3,62.88 69.6,65.88 73,67.98 71.6,67.98 70.1,67.38 71.2,65.68 71,62.88 70.15,63.78 69.3,64.58 74.5,66.48 74.6,65.28 73.7,67.28 68.03,59.55 67.08,58.39 69.02,59.59 66.29,56.8 70.15,59.63 67.11,55.49 71.55,55.47 69.06,54.5 71.01,54.79 70.12,54.46 72.7,55.51 70.95,59.48 73.37,58.35 68.07,54.46 68.53,57.45 77.3,70.68 68.56,56.68 76.3,70.68 70.56,60.52 70.9,45.88 83.6,48.68 81,51.38 83.6,49.73 84.8,53.78 85.95,53.78 83.75,53.83 82.8,53.78 81.75,53.83 87.1,54.68 83.6,47.53 82.7,45.98 88,65.93 87.1,65.93 86.2,65.93 85.2,65.98 84.55,65.13 84.55,64.03 83.7,64.03 76.8,72.58 71.9,66.28 89.1,57.48 70.15,51.38 73.05,52.68 71.85,52.03 70.1,50.28 70.15,46.73 70.1,47.98 70.9,52.03 79,52.68 87.9,55.58 82.5,51.33 80.9,52.68 78.8,55.78 78.8,54.98 73.4,59.18 73.25,60.54 89.6,64.48 80.15,62.63 79.45,66.38 82.05,63.98 90.7,63.48 90.55,64.43 89.2,59.93 89.15,58.33 88.75,56.43 89.15,60.73 89.15,59.18 89.75,61.28 83.55,50.78 81,53.78 88.6,65.43 88.75,64.53 90.55,61.33 90.7,62.43 78.5,62.68 59.27,56.88 67.28,26.01 65.82,15.88 67.45,15.87 69.06,15.88 58.18,27 58.19,28.92 61.3,40.44 64.47,40.44 67.64,40.44 70.8,40.44 73.97,40.44 65.89,36.04 61.97,36.86 69.62,28.35 69.62,27.59 69.62,26.64 69.62,24.89 68,24.84 71.7,22.9 69.89,22.85 68.4,22.8 71.7,24.1 71.7,25.3 71.7,27.1 71.7,28.7 73,28.7 74.4,28.7 68.9,30.6 70.4,30.6 71.8,30.6 63.9,31 63.1,67.7 78.3,62 68.6,26.6 67.28,26.86 67.9,27.3 68.03,26.01 76.53,59.04 75.5,57.97 76.54,58 75.5,56.94 76.56,56.94 77.61,56.96 40.11,20.32 41.17,20.32 42.25,20.31 41.17,19.29 42.2,19.27 41.2,18.19
  pour Top (isolate 0.2, rank 6): 0,0 99.8,0 99.8,94.7 0,94.7
  pour Bottom (isolate 0.2, rank 6): 0,0 99.8,0 99.8,94.7 0,94.7
  pour Route2 (isolate 0.2): 0.1,94.7 99.8,94.7 99.8,-0.1 0,-0.1 0,94.6
  pour route (isolate 0.2, rank 6): -0.01,0 -0.01,94.71 99.79,94.71 99.79,0
  pour Top: 39.4,21 42.9,21 42.9,17.5 39.4,17.5 39.4,20.7
  pour Top: 74.78,59.75 78.32,59.75 78.32,56.22 78.32,56.21 74.78,56.21
IRQ1
  Top 0.2: U11.19 40.66,25.45 40.32,25.79 J15.9
IRQ2
  Top 0.2: U13.19 77.05,51.78 77.39,51.45 J19.9
MISO1
  Top 0.2: U11.16 42.16,25.41 42.86,26.11 J15.5
MISO2
  Top 0.2: U13.16 75.55,51.83 74.84,51.12 J19.5
MMC_PWR  (via drill 0.25)
  Top 0.2: U7.2 v53.91,54.12 v53.92,54.12 | v61.39,44.91 61.39,42.34 58.88,39.83 58.88,37.78 59.47,37.19 R14.1 59.46,33.36 57.4,31.3 57.4,24.18 61.85,19.73 Q1.3
  Bottom 0.2: v53.92,54.12 54.78,53.26 54.78,53.24 61.39,46.63 v61.39,44.91
MMC_VDD  (via drill 0.25)
  Top 0.152: U9.P5 U9.N4 | U9.N4 U9.P3 | U9.M4 U9.N4
  Top 0.254: U9.C6 67.26,28.74 67.26,28.69 67.54,28.4 v67.54,28.36
  Top 0.3: U9.P3 65.65,23.05 65.64,23.04 65.64,21.7 v65.81,21.53 | U9.P5 66.65,23.05 66.65,23.04 66.65,22.27 v67.38,21.54 | v69.6,25.6 69.35,25.85 U9.J10 v68.65,25.85 U9.K9 68.65,25.05 v68.85,24.85 | U9.F5 arc90 U9.E6 67.15,28.01 67.54,28.4
  other vias: 63.76,21.55 69.05,21.59 71.12,21.59 73.32,21.58 73.33,22.89 73.33,24.11 73.33,25.66 71.12,19.05 73.26,19.05 75.44,24.91 75.48,23.12 75.53,21.59 75.53,19.05 63.73,19.74 65.81,19.74 67.43,19.73 69.05,19.74
  pour Top: 62.63,15.05 64.57,15.05 64.57,17.78 76.4,17.78 76.4,26.8 72.28,26.8 72.28,22.39 62.63,22.39
  pour route: 62.34,17.77 62.34,29.08 76.45,29.08 76.45,17.77
MOSI1
  Top 0.2: J15.7 41.66,27.91 U11.17
MOSI2
  Top 0.2: J19.7 76.05,49.33 U13.17
N$1
  Top 0.2: D3.A R3.1
N$2
  Top 0.39: C64.1 J11.FEED
N$3
  Top 0.4: R19.2 19.95,75.1 D7.1
N$5
  Top 0.2: R27.1 D4.A
N$7
  Top 0.3: U11.9 U11.10
N$8
  Top 0.2: 38.85,16.3 39.55,17 U11.1
  Top 0.35: C46.1 38.85,16.3
N$9
  Top 0.2: U11.7 43.2,17 43.34,16.86 43.34,16.38 C47.2
N$10
  Top 0.2: C56.1 U12.4
N$11
  Top 0.35: L6.1 C48.2 C42.1
N$12
  Top 0.2: X3.3 36.55,15.65 36.51,15.65 36.35,15.8 C45.2
N$13
  Top 0.3: U13.9 U13.10
N$14
  Top 0.2: 78.85,60.93 78.15,60.23 U13.1
  Top 0.35: C62.1 78.85,60.93
N$15
  Top 0.2: U13.7 74.5,60.23 74.2,60.53 C63.2
N$16
  Top 0.2: C72.1 U14.4
N$17
  Top 0.35: L10.1 C64.2 C58.1
N$18
  Top 0.2: X4.3 81.15,61.58 81.2,61.58 81.35,61.43 C61.2
N$270
  Top 0.25: R1.1 D1.A
N$271
  Top 0.25: R2.1 D2.A
N$300
  Top 0.38: J4.FEED CM3.RF
N$400
  Top 0.2: R4.1 D5.A
N$406
  Top 0.508: J5.P$4 17.7,25.53 JP8.2
NRST
  Top 0.2: U7.7 48.41,51.65 50.25,51.65 51,50.9 51,48.3 40.6,37.9 24.09,37.9 23,36.81 TP2.1 23,9.87 J7.10
OPD-3.3V
  pour Top (isolate 0.2, no thermals): 41.1,66.8 41.1,68.1 40.6,68.6 40.6,69.9 38.2,69.9 38.2,66.8
OPD_!FAULT  (via drill 0.25)
  Top 0.152: v54.77,54.95 54.75,54.95 | 54.75,56.46 U7.55
  Top 0.2: 54.75,54.95 54.75,56.46 | U1.6 48.67,66.28 R16.1 TP8.1
  Bottom 0.2: v54.77,54.95 54.55,54.95 48.7,60.79 TP8.1
OPD_ISET
  Top 0.2: R24.1 TP14.1 46.08,65.62 U1.5 44.7,65.61 R36.2
OPD_ISET_IN  (via drill 0.25)
  Top 0.152: 55.23,45.28 U7.27 | R24.2 v47,61.3
  Top 0.2: v55.23,50.58 55.23,45.28
  Bottom 0.152: 55.2,50.6 v55.23,50.58
  Bottom 0.2: 55.2,50.6 55.2,52.19 47,60.39 v47,61.3
OPD_PWR
  Top 0.4: R11.1 R8.1 56,75.7 54.88,76.82 | 54.88,76.82 54.83,76.87 47.26,69.3 C4.1 | 54.88,76.82 JP1.6
  Bottom 0.5: J6.15 J6.16
  Bottom 0.508: J6.16 53.08,83.08 JP1.5 JP1.6
  pour Top (isolate 0.2, no thermals): 44.1,66.8 46.4,66.8 46.4,69.8 44.5,69.8 44.5,68.1 44.1,67.7
OPD_SCL  (via drill 0.25)
  Top 0.2: U7.61 51.73,60.06 v51.6,60.2 | R8.2 57.4,78.72 JP1.4
  Bottom 0.2: v51.6,60.2 52.86,60.2 53.9,61.24 53.9,75.19 57.42,78.72 JP1.4
  Bottom 0.3: J6.13 J6.14
  Bottom 0.305: J6.14 54.34,84.36 JP1.3 JP1.4
OPD_SDA  (via drill 0.25)
  Top 0.152: U7.62 51.23,56.51 51.24,56.51
  Top 0.2: 51.24,56.51 51.24,59.06 v51.2,59.1 | R11.2 59.96,76.74 JP1.2
  Bottom 0.2: v51.2,59.1 53.49,59.1 54.39,60 54.39,73.57 59.56,78.74 JP1.2
  Bottom 0.3: J6.11 J6.12
  Bottom 0.305: J6.12 55.62,85.62 JP1.1 JP1.2
PA1
  Top 0.2: TP5.1 45.15,45.45 47.32,47.62 U7.15
PA15
  Top 0.152: TP6.1 58.09,58.03 57.84,57.78 57.63,57.78 57.23,57.38 U7.50
PB10
  Top 0.152: U7.29 56.23,44.44 TP4.1
PB12  (via drill 0.25)
  Top 0.2: U7.33 58.33,47.12 v58.3,47.1
  Bottom 0.127: v58.3,47.1 55.4,47.1 49.7,52.8 28,52.8 JP11.1
PC0  (via drill 0.25)
  Top 0.127: v29.8,51.6 29.8,52.7 JP11.9
  Top 0.2: U7.8 49.58,51.12 v49.7,51
  Bottom 0.127: v49.7,51 48.8,51.9 30.1,51.9 v29.8,51.6
PC1  (via drill 0.25)
  Top 0.127: v29.8,50.2 29.8,50.9 29.2,51.5 29.2,52.7 24.4,57.5 22.5,57.5 21.27,58.73 JP11.10
  Top 0.2: U7.9 47.48,50.62 v47,51.1
  Bottom 0.127: v47,51.1 46.8,51.3 30.9,51.3 v29.8,50.2
PC2  (via drill 0.25)
  Top 0.127: v29,50.2 24.3,54.9 22.52,54.9 JP11.8
  Top 0.2: U7.10 49.62,50.12 v49.7,50.2
  Bottom 0.127: v49.7,50.2 48.3,51.6 30.39,51.6 v29,50.21 v29,50.2
PC3  (via drill 0.25)
  Top 0.127: v30.6,50.2 30.1,49.7 27.4,49.7 24.7,52.4 22.5,52.4 21.25,53.65 JP11.6
  Top 0.2: U7.11 47.48,49.62 47.2,49.9 47.2,50.2 46.9,50.5 46.3,50.5 v46.25,50.45
  Bottom 0.127: v46.25,50.45 45.71,51 31.4,51 v30.6,50.2
PC4  (via drill 0.25)
  Top 0.2: U7.24 53.73,46.56 v53.3,47
  Bottom 0.127: v53.3,47 53.3,48.4 49.5,52.2 29.4,52.2 24.1,46.9 21.3,46.9 19.8,48.4 19.8,49.68 JP11.4
PC5  (via drill 0.25)
  Top 0.2: U7.25 54.23,46.77 v54,47
  Bottom 0.127: v54,47 54,48.1 49.6,52.5 29.2,52.5 24.1,47.4 22.4,47.4 JP11.2
PWRAMP1
  Top 0.2: U11.20 40.16,24.45 39.05,25.56 J15.11
PWRAMP2
  Top 0.2: U13.20 77.55,52.78 78.66,51.67 J19.11
RADIO1_CS  (via drill 0.25)
  Top 0.2: U7.37 58.67,49.12 58.3,49.5 57.2,49.5 56.5,48.8 v56.5,46.6
  Bottom 0.2: v56.5,46.6 56.5,45.9 51.8,41.2 50.2,41.2 45.4,36.4 J15.2
RADIO1_IRQ
  Top 0.2: U7.20 51.73,43.62 52.4,42.96 52.4,41.5 52.1,41.2 50.2,41.2 48.5,39.5 48.5,36.4 45.9,33.8 41.5,33.8 40.3,32.6 40.3,29.26 J15.10
RADIO2_CS  (via drill 0.25)
  Top 0.2: U7.38 62.77,49.62 v62.88,49.64
  Bottom 0.2: J19.2 71.22,47.99 69.59,49.62 v62.88,49.64
RADIO2_IRQ
  Top 0.2: U7.41 63.58,51.12 69.3,45.4 76.83,45.4 77.39,45.95 J19.10
RF1
  Top 0.38: J2.FEED CM1.RF
RF2
  Top 0.38: J3.FEED CM2.RF
RX1
  Top 0.39: J10.FEED 40.92,10.09 C48.1
SCLK1
  Top 0.2: U11.15 42.66,24.5 44.16,26 44.16,27.95 J15.3
SCLK2
  Top 0.2: U13.15 75.05,52.73 73.55,51.23 73.55,49.29 J19.3
SDIO_CK  (via drill 0.25)
  Top 0.2: v62.73,46.28 62.73,42.76 60.73,40.76 R14.9 60.73,37.93 61.06,37.6 61.06,37.59 61.42,37.23 61.42,34.9 61.37,34.74 v61.37,30.36 61.19,30.18 61.19,30.17 60.92,29.9 60.46,29.9 TP7.1 | v55.73,53.95 U7.53
  Top 0.3: U9.M6 67.15,24.55 v67.4,24.8
  Bottom 0.2: v55.73,53.95 55.76,53.95 62.73,46.98 v62.73,46.28 | v61.37,30.36 61.37,29.86 65.96,25.26 66.94,25.26 v67.4,24.8
SDIO_CMD  (via drill 0.25)
  Top 0.2: v55.23,53.43 U7.54 | U7.54 | v60.73,30.36 R14.2 60.73,37.46 60.15,38.05 60.15,40.63 62.06,42.55 v62.06,45.59
  Top 0.3: v66.4,24.78 66.65,24.53 U9.M5
  Bottom 0.2: v55.23,53.43 62.06,46.61 v62.06,45.59 | v66.4,24.78 66.24,24.94 65.83,24.94 60.73,30.03 v60.73,30.36
SDIO_D0
  Top 0.2: U7.39 63.16,50.12 65.23,48.06 65.23,39.03 67.26,37 R15.1 67.27,35.62 67.27,34.5 65.65,32.88 U9.A3
SDIO_D1
  Top 0.2: U7.40 63.37,50.62 65.77,48.23 65.77,43.33 68.53,40.57 R15.9 68.55,38.76 68.55,37.57 67.84,36.86 67.84,34.61 66.15,32.92 U9.A4
SDIO_D2  (via drill 0.25)
  Top 0.2: v56.74,55 U7.51 | v66.32,45.45 v66.31,45.44 66.31,43.41 69.11,40.61 69.11,37.67 68.53,37.09 R15.2 68.53,34.72 66.65,32.84 U9.A5
  Bottom 0.2: v56.74,55 66.29,45.45 v66.32,45.45
SDIO_D3  (via drill 0.25)
  Top 0.152: U9.A1 U9.B2
  Top 0.2: v56.24,54.48 56.24,56.48 U7.52 | v63.4,46.97 63.27,46.84 R14.7 63.27,37.53 63.85,36.95 63.85,34.68 64.65,33.88 U9.A1
  Bottom 0.2: v56.24,54.48 56.26,54.48 63.4,47.33 v63.4,46.97
SDIO_D4
  Top 0.152: U9.B3 U9.A2
  Top 0.2: R14.6 64.54,36.94 65.12,36.35 65.12,29.88 U9.A2
SDIO_D5  (via drill 0.25)
  Top 0.152: U9.B4 U9.C3 U9.D3 65.65,28.34 65.99,27.99 65.99,26.83 v66.14,26.68
  Top 0.2: v62.63,30.36 62.63,34.17 62.69,34.9 62.69,36.93 61.99,37.63 R14.8
  Bottom 0.2: v66.14,26.68 65.65,26.68 62.63,29.7 v62.63,30.36
SDIO_D6  (via drill 0.25)
  Top 0.152: U9.B5 U9.C5
  Top 0.2: R14.4 v63.27,30.36
  Top 0.305: v66.69,28.35 66.65,28.39 U9.C5
  Bottom 0.2: v66.69,28.35 64.44,28.35 63.27,29.52 v63.27,30.36
SDIO_D7  (via drill 0.25)
  Top 0.152: U9.B6 U9.C7 67.67,28.85 68.01,28.51 68.23,28.51 v68.36,28.38
  Top 0.2: R15.3 69.8,34.63 67.95,32.78 v67.95,30.35
  Bottom 0.2: v68.36,28.38 68.36,29.94 v67.95,30.35
SDIO_RST  (via drill 0.25)
  Top 0.2: R14.3 v62,30.36
  Top 0.3: U9.K5 66.52,25.35 v66.15,25.72
  Bottom 0.2: v66.15,25.72 62,29.87 v62,30.36
SPARE1
  Bottom 0.3: J6.9 J6.10 | 63.25,80.25 63.2,80.3
  Bottom 0.305: J6.10 56.88,85.61 59.1,83.4 60.1,83.4 63.2,80.3 | JP2.5 63.25,80.25
SPARE2
  Bottom 0.3: J6.7 J6.8
  Bottom 0.305: JP2.4 65.66,81.52 62.68,81.52 59.5,84.7 58.7,84.7 58.16,85.25 J6.8
SPARE3
  Bottom 0.3: J6.5 J6.6
  Bottom 0.305: J6.6 59.42,85.86 62.5,82.79 JP2.3
SPARE4
  Bottom 0.3: J6.3 J6.4
  Bottom 0.305: J6.4 60.7,85.86 62.48,84.07 65.67,84.07 JP2.2
SPARE5
  Bottom 0.3: J6.1 J6.2
  Bottom 0.305: J6.2 63.28,87.36 64.39,86.25 JP2.1
SPI1_MISO  (via drill 0.25)
  Top 0.2: U7.22 52.73,43.77 53.4,43.1 TP22.1 v53.4,37.9 | J15.6 42.86,32.76 43.25,33.15 46.17,33.15 49.15,36.13 49.15,37.35 49.7,37.9 v51.9,37.9
  Bottom 0.2: v51.9,37.9 v53.4,37.9 | TP22.1 54.29,41.19 58.5,41.19 59.41,42.1 72.33,42.1 73.9,43.68 73.9,45.11 74.85,46.06 J19.6
SPI1_MOSI  (via drill 0.25)
  Top 0.152: 53.9,38.5 v54.03,38.5
  Top 0.2: U7.23 53.23,43.87 54.3,42.8 54.3,40.3 | 54.3,40.3 54.3,39.7 53.9,39.3 53.9,38.5 | TP18.1 54.3,40.3 | J15.8 41.59,32.96 42.1,33.47 46.03,33.47 48.83,36.27 48.83,38.03 49.3,38.5 v52.4,38.5
  Bottom 0.2: v52.4,38.5 v54.03,38.5 | TP18.1 58.07,40.3 59.54,41.78 72.46,41.78 74.23,43.54 74.23,44.36 76.14,46.27 76.16,46.27 76.16,47.95 J19.8
SPI1_SCK  (via drill 0.25)
  Top 0.2: U7.21 52.23,43.77 52.9,43.11 52.9,41.3 52.5,40.9 52.5,40.3 | v52.9,37.3 52.9,37.4 | 52.9,37.4 52.9,39.1 52.5,39.5 52.5,40.3 | TP23.1 52.5,40.3 | J15.4 44.1,29.27 44.1,32.7 44.22,32.82 46.31,32.82 49.48,35.99 49.48,37.08 49.8,37.4 52.9,37.4
  Bottom 0.2: TP23.1 53.73,42.43 72.19,42.43 73.58,43.81 J19.4
SPI2_MISO  (via drill 0.25)
  Top 0.2: U7.35 58.08,48.12 v57.9,48.3
  Bottom 0.127: v57.9,48.3 55,48.3 49.9,53.4 27.3,53.4 27,53.7 23.82,53.7 JP11.5
SPI2_MOSI  (via drill 0.25)
  Top 0.2: U7.36 58.48,48.62 v58.2,48.9
  Bottom 0.127: v58.2,48.9 54.8,48.9 50,53.7 27.6,53.7 25.1,56.2 JP11.7
SPI2_SCK  (via drill 0.25)
  Top 0.2: U7.34 57.88,47.62 v57.8,47.7
  Bottom 0.127: v57.8,47.7 55.2,47.7 49.8,53.1 25.76,53.1 JP11.3
SWCLK
  Top 0.2: U7.49 57.73,54.53 40.7,37.5 25,37.5 23.9,36.4 23.9,8.1 19.4,8.1 19.23,8.27 J7.4
SWDIO
  Top 0.2: U7.46 57.29,53.62 42.66,39 40.76,37.1 25.3,37.1 24.3,36.1 24.3,7.7 18.5,7.7 17.96,8.24 J7.2
SYSCLK1
  Top 0.39: U11.13 J8.FEED
SYSCLK2
  Top 0.39: J14.FEED 74.28,57 U13.13
TPS62111-PG
  Top 0.2: U5.13 26.93,70.33 26.15,69.55 TP16.1
TPS62111-SYNC  (via drill 0.25)
  Top 0.2: v30.4,74.4 30.27,74.28 U5.5 | R7.1 29.3,77 29.6,77.3 TP19.1 R10.2
  Bottom 0.2: v30.4,74.4 30.4,76.9 TP19.1
TPS62111_SW
  pour Top (no thermals): 29,70.6 28.4,70.6 28.4,68.4 29,68.4
TX1
  Top 0.39: C49.1 43.99,13.43 J9.FEED
TX2
  Top 0.39: C65.1 J13.FEED
USART2_RX  (via drill 0.25)
  Top 0.2: U7.17 49.83,45.27 v41.06,36.51 | v19.02,30.67 13.56,30.67 J5.P$2
  Bottom 0.2: v19.02,30.67 24.86,36.51 v41.06,36.51
USART2_TX  (via drill 0.25)
  Top 0.2: v45.8,44.2 48.38,46.78 U7.16
  Bottom 0.2: v45.8,44.2 31.82,44.2 15.69,28.07 J5.P$3
VBUS
  Top 0.2: R5.2 47,75.7 C1.1
  pour Top (isolate 0.2, no thermals): 43.6,79.63 43.6,75.27 47.9,75.27 47.9,79.63
  pour Bottom (isolate 0.2, no thermals): 46.2,89.98 47.99,89.98 49.85,90 49.85,83.21 48.4,81.76 48.4,77.6 43.3,77.6 43.3,81.7 46.2,84.6
VBUSP  (via drill 0.25)
  Top 0.152: C10.1 27.83,75.4
  Top 0.2: JP8.1 20.27,15.53 | U5.4 U5.3 | U5.8 27.73,75.3 27.83,75.4
  Top 0.203: 20.27,15.53 R1.2
  Top 0.4: v26.3,74.3 27.7,74.3 U5.8
  route 0.35: v26.3,74.3 24.33,74.3 JP4.2 JP4.1 10.1,41.4 20.27,31.23 JP8.1
  other vias: 37.4,75.7 39.4,76.4 38.8,76.4 38.2,76.4 37.6,76.4 36.8,75.7
  pour Top (isolate 0.2, no thermals): 33.7,71.9 33.7,73.8 35,75.1 39.9,75.1 40,75.2 40,76.8 34.5,76.8 33.7,76 27.3,76 27.3,74 30.4,74 30.4,71.9
  pour route (isolate 0.2, no thermals): 36.3,76.9 39.7,76.9 39.7,75.1 36.3,75.1
VCAP
  Top 0.3: U7.30 56.73,42.63
  Top 0.4: 56.73,42.63 C14.1
VDD_IO-1
  Top 0.2: C55.1 C54.1 | C53.1 C54.1 | U11.23 37.1,20.25 C54.1
  Top 0.4: C53.1 37.01,22.2 36.8,22.41 R33.1
  pour Top: 36.4,21.8 36.4,18.6 36.6,18.4 37.8,18.4 38.1,18.7 38.1,21.6 37.9,21.8
VDD_IO-2
  Top 0.2: C69.1 C70.1 | C71.1 C70.1 | U13.23 80.6,56.98 C70.1
  Top 0.4: C69.1 80.7,55.03 80.9,54.83 R40.1
  pour Top (isolate 0.2): 79.45,55.48 81.1,55.48 81.1,58.79 79.45,58.79
VDDI
  Top 0.3: 60.85,28.85 C19.1 C21.1
  Top 0.305: U9.C2 U9.C1 60.85,28.85
VIN-1V8-1
  Top 0.39: R32.2 29.61,17.04 U12.1 28.7,15.71 28.7,13.8 | C57.1 28.7,13.8 | 28.7,13.8 U12.3
VIN-1V8-2
  Top 0.39: R39.2 U14.1 89,61.53 89,63.43 | C73.1 89,63.43 | 89,63.43 U14.3
WDT
  Top 0.2: U7.14 47.02,48.12 46,47.1 40.9,47.1 21,67 12.8,67 10.8,69 TP3.1 R3.2 12.44,73.67 U6.1
WDT-PWR  (via drill 0.25)
  Top 0.2: U6.4 13.97,71.03 14,71 v14,70.9
  Bottom 0.2: v14,70.9 17.1,74 v17.1,74.2
  pour Top (isolate 0.2, no thermals): 15.8,73.5 17.9,73.5 17.9,78 15.8,78

## Text on the board
tPlace: 5 | 4 | 3 | 2 | 10 | 9 | 8 | 7 | 6 | 5 | 4 | 3 | 2 | 1 | 1 | C2L | C2H | VBUSP | WDT | Rx | PG | Tx | +3.3V | 1V8 | PWR | 3.3V | CLK-Out | VBUSP | PC13 | AX5043 | SPI / IRQ | 1 | PA1 | CS | SCLK | IRQ | PTT | GND | MISO | MOSI | PB10 | SCK/MISO/MOSI | Team 7 | GND | MOSI | MISO | SCLK | PTT | IRQ | CS | SPI / IRQ | AX5043 | FTDI VUSB / to VBUS | eMMC | OreSat C3 v1.0 | 2019/11/14 | CLK-Out | VBUSP | 3.3V | PWR | 1V8 | NRST | Tx | Rx